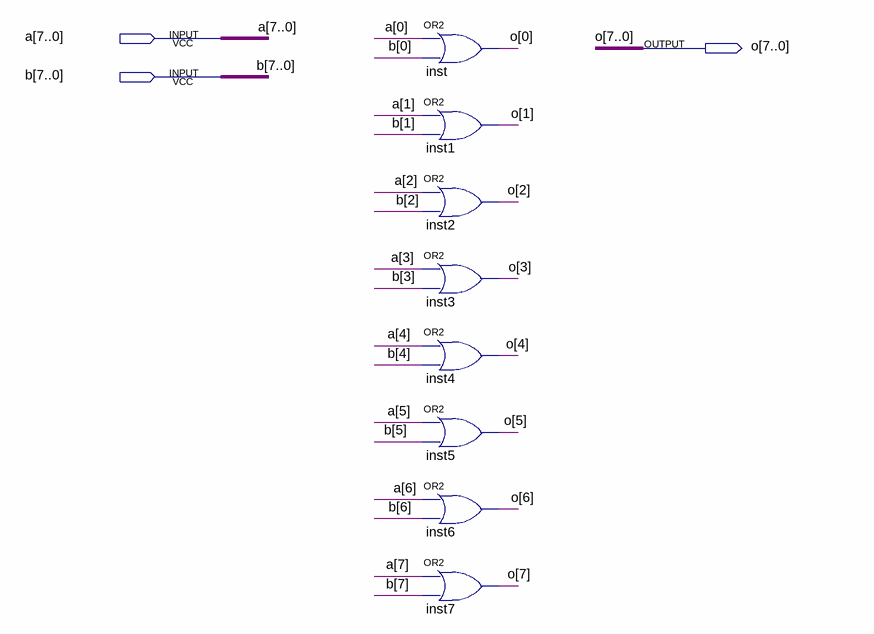
[diagram p0: schematic sheet]
// Quartus schematic 8bitor.bdf as structural Verilog: 8 symbols, 3 pins
module \8bitor  (
  input  [7:0] a,
  input  [7:0] b,
  output [7:0] o
);

  or inst (o[0], a[0], b[0]);
  or inst1 (o[1], a[1], b[1]);
  or inst2 (o[2], a[2], b[2]);
  or inst3 (o[3], a[3], b[3]);
  or inst4 (o[4], a[4], b[4]);
  or inst5 (o[5], a[5], b[5]);
  or inst6 (o[6], a[6], b[6]);
  or inst7 (o[7], a[7], b[7]);
endmodule
